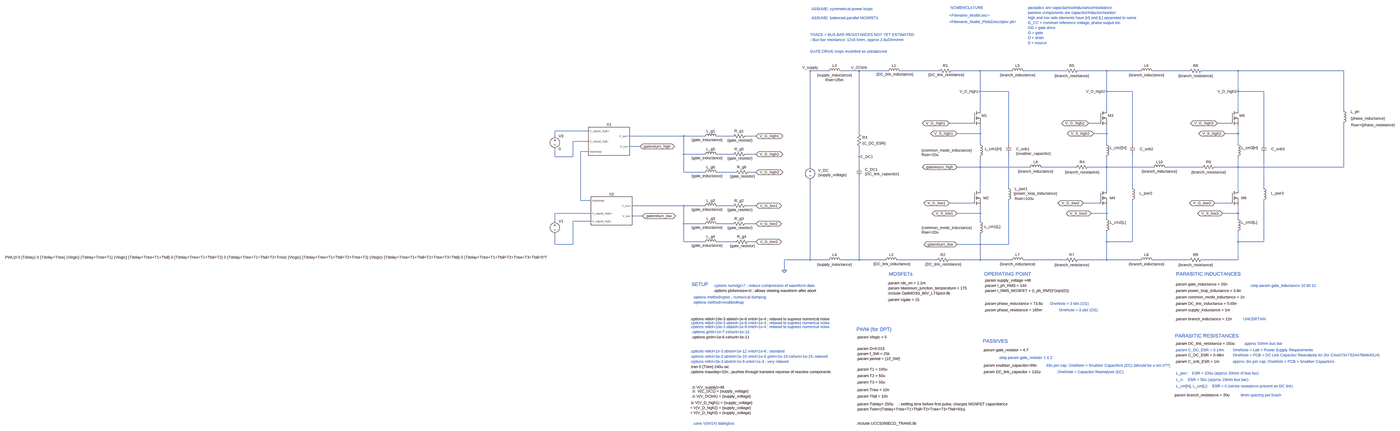
[diagram p0: schematic InverterUnbalancedDriverDPT.asc, whole sheet]
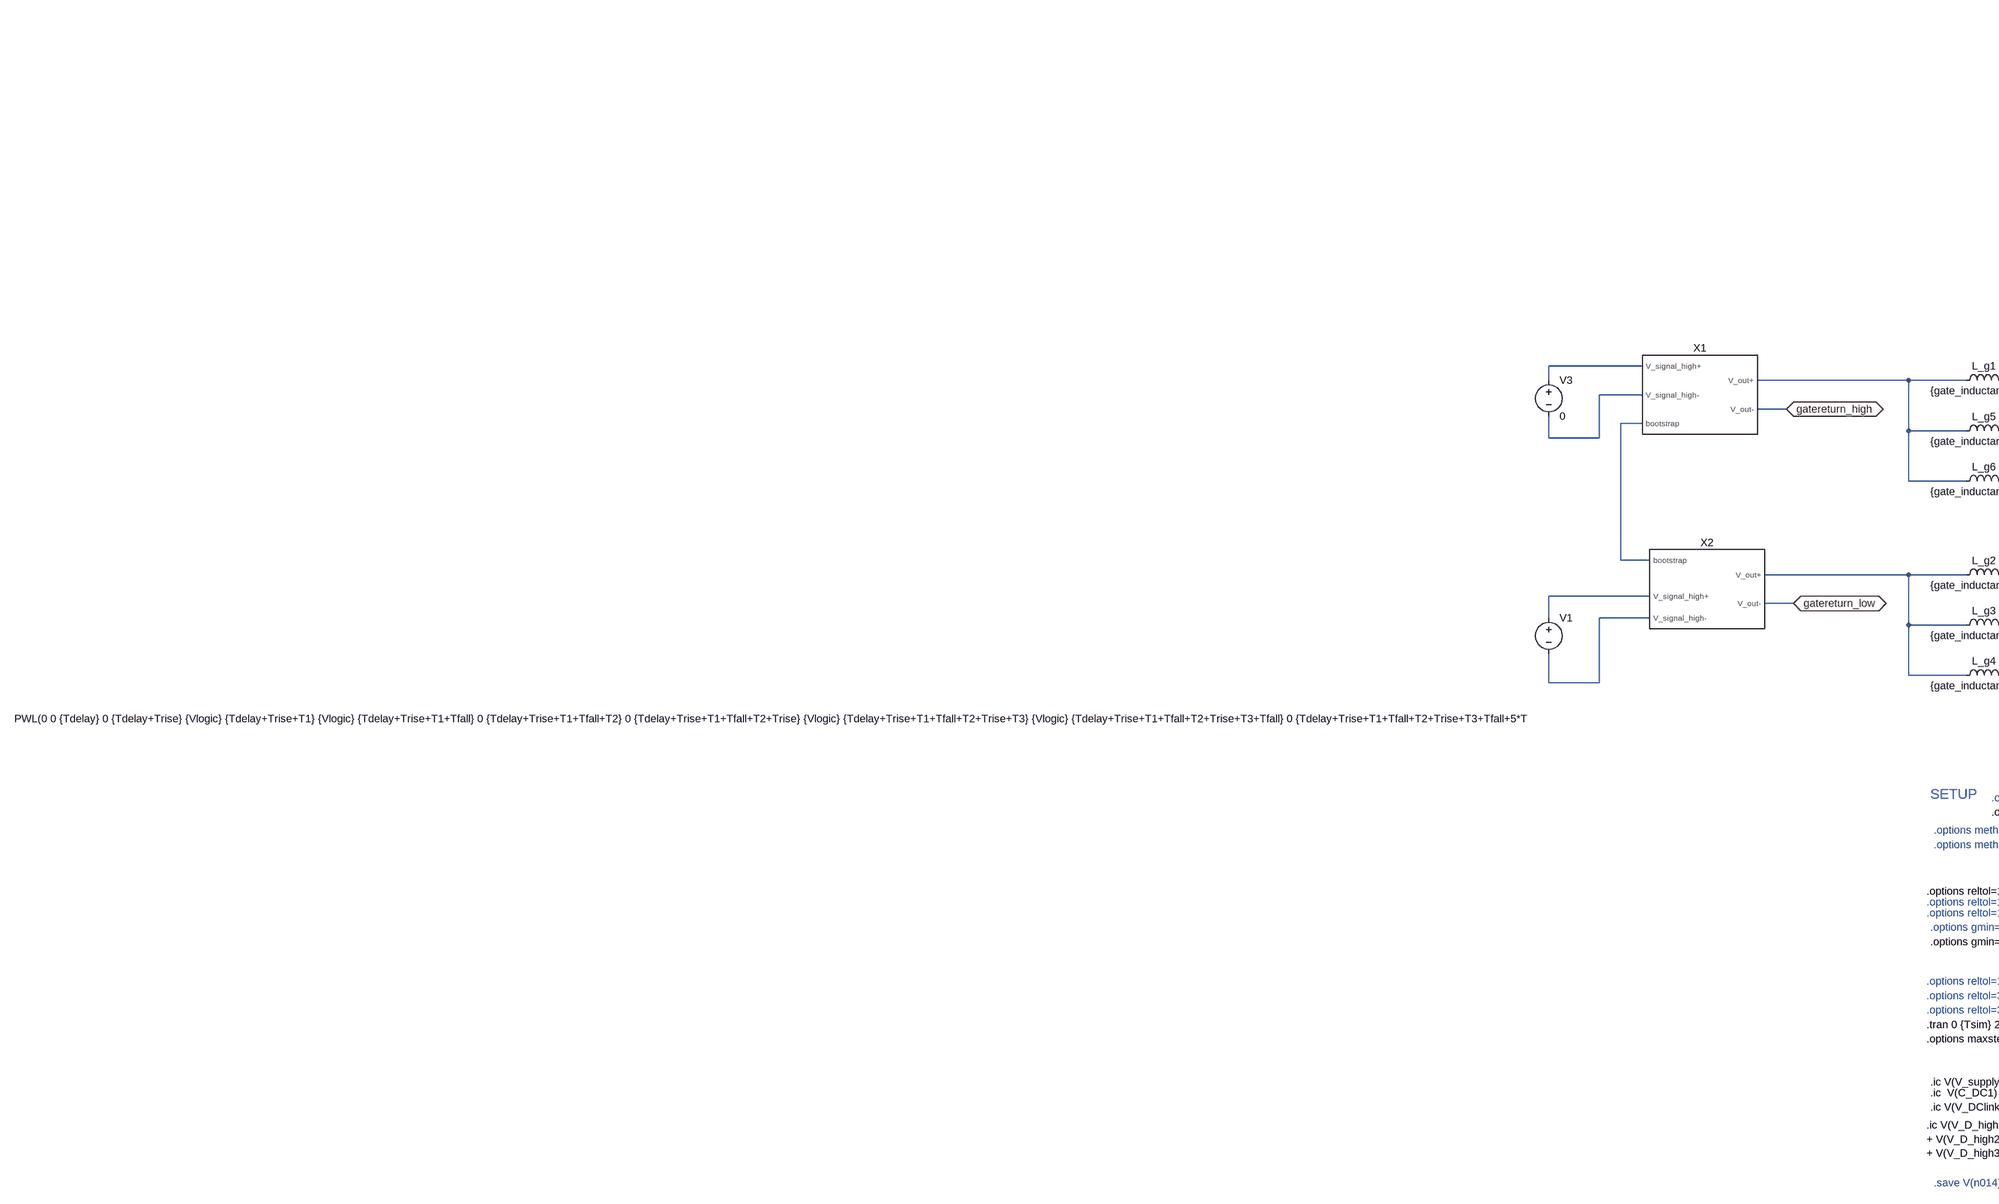
[diagram p1: schematic InverterUnbalancedDriverDPT.asc, part, row 1 of 1, column 1 of 2]
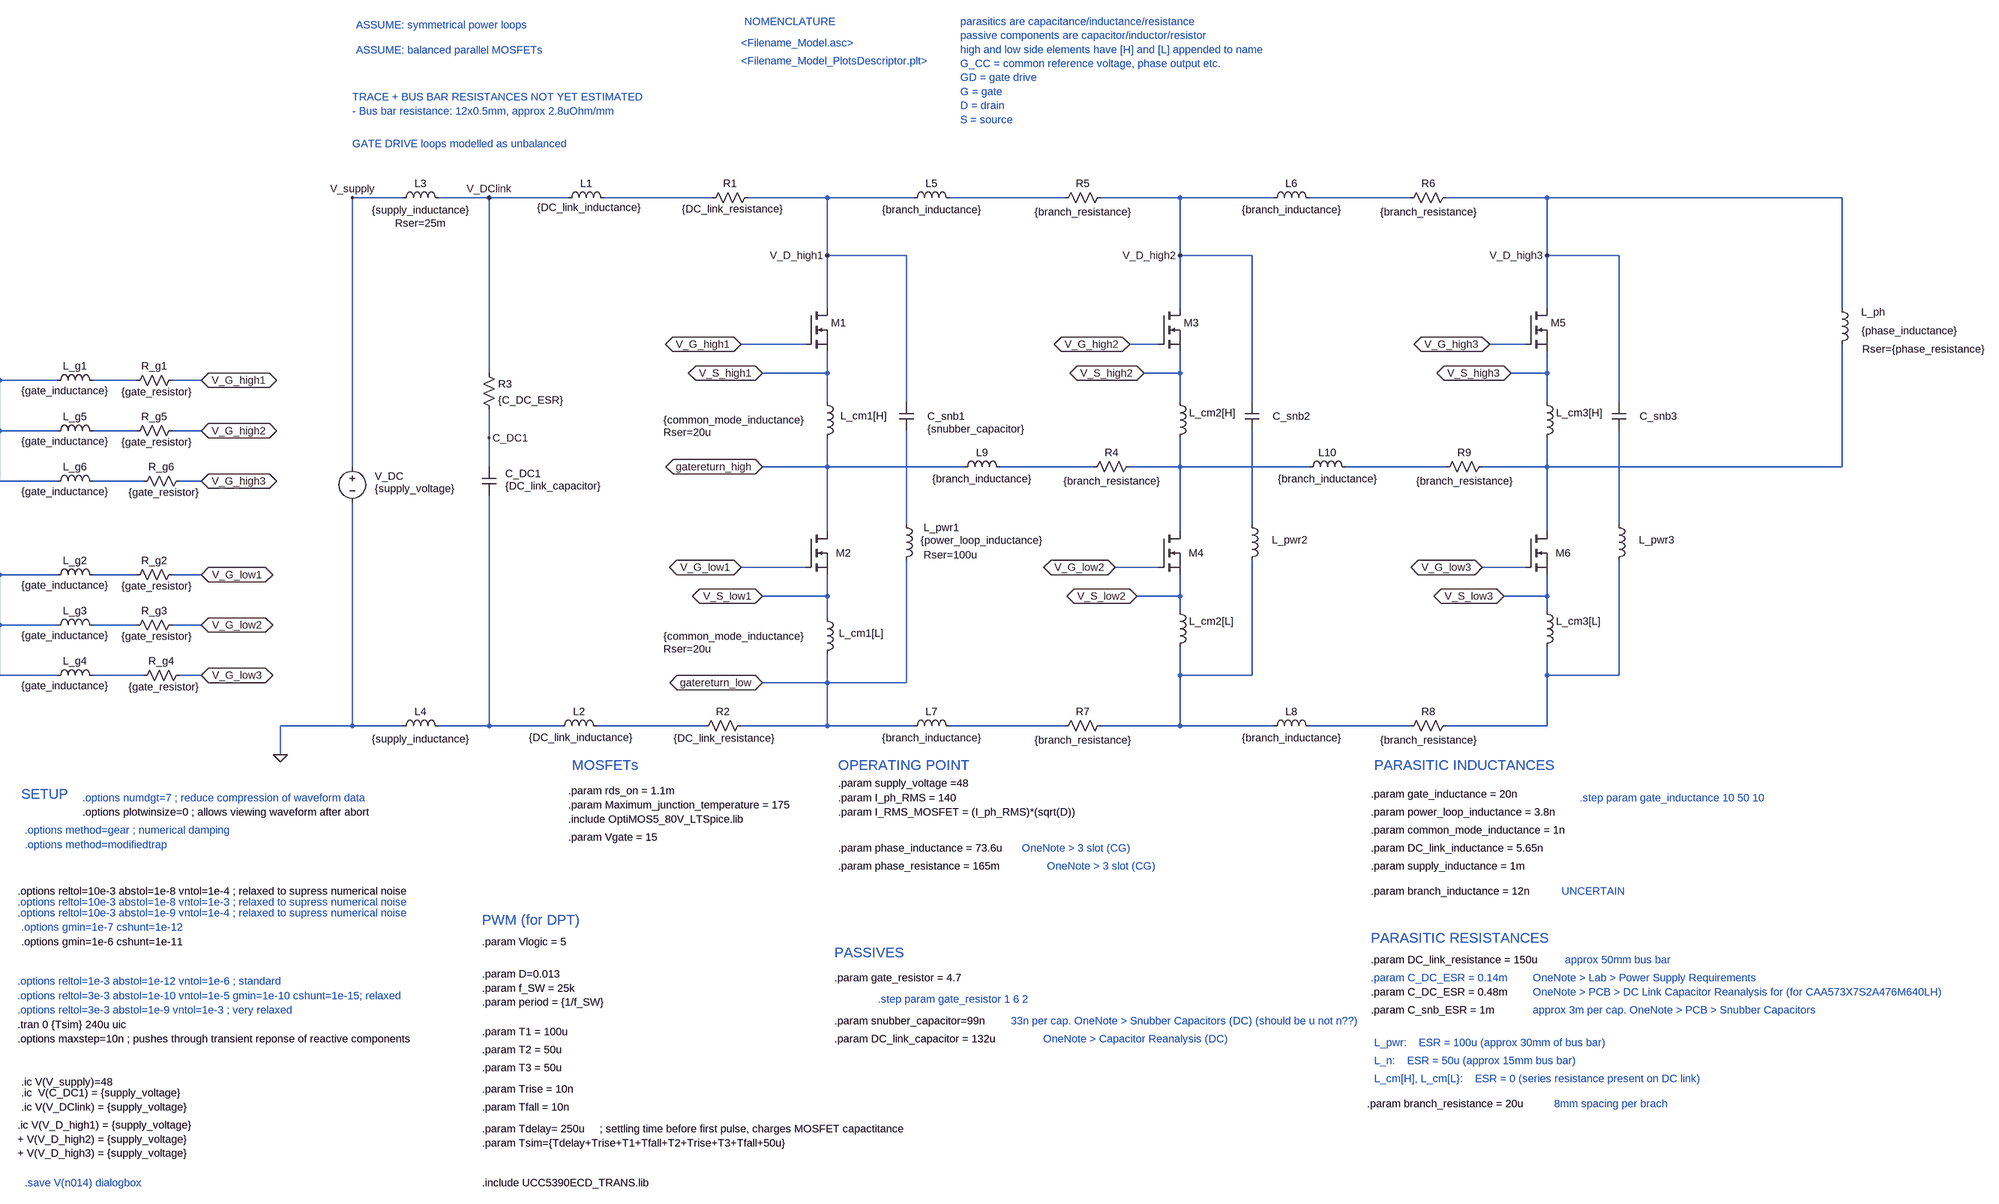
[diagram p2: schematic InverterUnbalancedDriverDPT.asc, part, row 1 of 1, column 2 of 2]
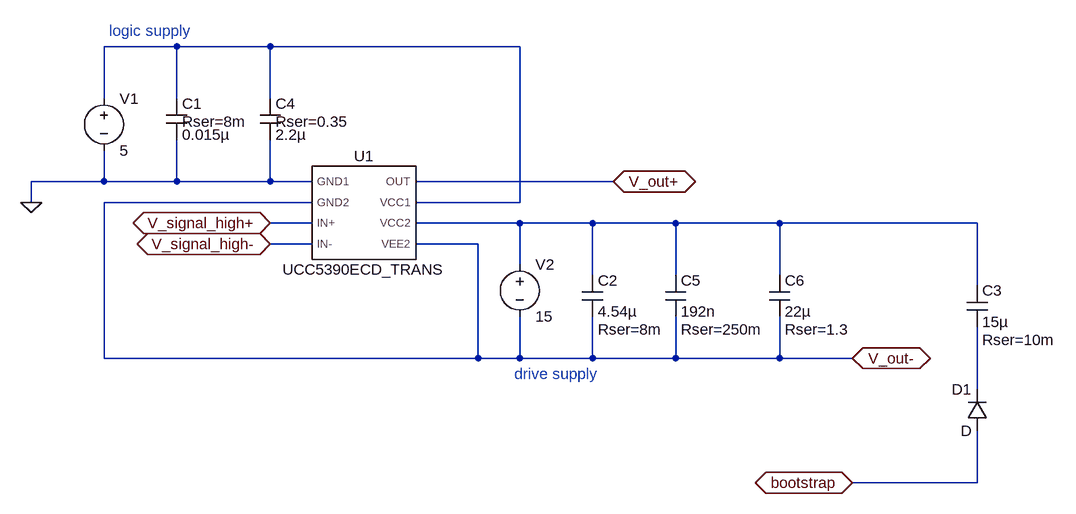
[diagram p3: sub-circuit gatedriverhigh.asc]
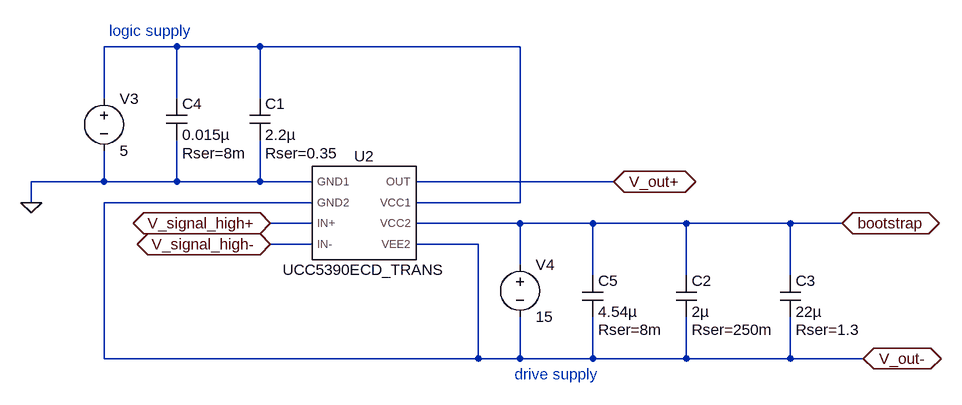
[diagram p4: sub-circuit gatedriverlow.asc]
InverterUnbalancedDriverDPT.asc, the LTspice schematic file:
Version 4.1
SHEET 1 7948 3392
WIRE 1136 -928 1024 -928
WIRE 1328 -928 1216 -928
WIRE 1504 -928 1328 -928
WIRE 1824 -928 1584 -928
WIRE 2080 -928 1904 -928
WIRE 2272 -928 2080 -928
WIRE 2608 -928 2352 -928
WIRE 2864 -928 2688 -928
WIRE 3072 -928 2864 -928
WIRE 3376 -928 3152 -928
WIRE 3680 -928 3456 -928
WIRE 4336 -928 3680 -928
WIRE 2080 -800 2080 -928
WIRE 2256 -800 2080 -800
WIRE 2864 -800 2864 -928
WIRE 3024 -800 2864 -800
WIRE 3680 -800 3680 -928
WIRE 3840 -800 3680 -800
WIRE 2080 -672 2080 -800
WIRE 2864 -672 2864 -800
WIRE 3680 -672 3680 -800
WIRE 4336 -672 4336 -928
WIRE 2032 -592 1888 -592
WIRE 2080 -592 2080 -608
WIRE 2816 -592 2752 -592
WIRE 2864 -592 2864 -608
WIRE 3632 -592 3552 -592
WIRE 3680 -592 3680 -608
WIRE -352 -544 -560 -544
WIRE 1328 -528 1328 -928
WIRE 2080 -528 2080 -576
WIRE 2080 -528 1936 -528
WIRE 2864 -528 2864 -576
WIRE 2864 -528 2784 -528
WIRE 3680 -528 3680 -576
WIRE 3680 -528 3600 -528
WIRE -560 -512 -560 -544
WIRE 240 -512 -96 -512
WIRE 368 -512 240 -512
WIRE 544 -512 448 -512
WIRE 688 -512 624 -512
WIRE -352 -480 -448 -480
WIRE 2080 -464 2080 -528
WIRE 2256 -464 2256 -800
WIRE 2864 -464 2864 -528
WIRE 3024 -464 3024 -800
WIRE 3680 -464 3680 -528
WIRE 3840 -464 3840 -800
WIRE -32 -448 -96 -448
WIRE -352 -416 -400 -416
WIRE 240 -400 240 -512
WIRE 368 -400 240 -400
WIRE 544 -400 448 -400
WIRE 688 -400 624 -400
WIRE -560 -384 -560 -432
WIRE -448 -384 -448 -480
WIRE -448 -384 -560 -384
WIRE 1328 -384 1328 -448
WIRE 1024 -320 1024 -928
WIRE 1328 -320 1328 -384
WIRE 2080 -320 2080 -384
WIRE 2080 -320 1936 -320
WIRE 2384 -320 2080 -320
WIRE 2672 -320 2464 -320
WIRE 2864 -320 2864 -384
WIRE 2864 -320 2752 -320
WIRE 3152 -320 2864 -320
WIRE 3456 -320 3232 -320
WIRE 3680 -320 3680 -384
WIRE 3680 -320 3536 -320
WIRE 4336 -320 4336 -592
WIRE 4336 -320 3680 -320
WIRE 240 -288 240 -400
WIRE 368 -288 240 -288
WIRE 560 -288 448 -288
WIRE 688 -288 640 -288
WIRE 2256 -192 2256 -400
WIRE 3024 -192 3024 -400
WIRE 3840 -192 3840 -400
WIRE 2080 -176 2080 -320
WIRE 2864 -176 2864 -320
WIRE 3680 -176 3680 -320
WIRE -400 -112 -400 -416
WIRE -336 -112 -400 -112
WIRE 2032 -96 1888 -96
WIRE 2816 -96 2720 -96
WIRE 3632 -96 3536 -96
WIRE 240 -80 -80 -80
WIRE 368 -80 240 -80
WIRE 544 -80 448 -80
WIRE 688 -80 624 -80
WIRE -336 -32 -560 -32
WIRE 2080 -32 2080 -80
WIRE 2080 -32 1936 -32
WIRE 2864 -32 2864 -80
WIRE 2864 -32 2768 -32
WIRE 3680 -32 3680 -80
WIRE 3680 -32 3584 -32
WIRE -16 -16 -80 -16
WIRE 2864 0 2864 -32
WIRE 3680 0 3680 -32
WIRE -560 16 -560 -32
WIRE -336 16 -448 16
WIRE 2080 16 2080 -32
WIRE 240 32 240 -80
WIRE 368 32 240 32
WIRE 544 32 448 32
WIRE 688 32 624 32
WIRE 240 144 240 32
WIRE 368 144 240 144
WIRE 560 144 448 144
WIRE 688 144 640 144
WIRE 2864 144 2864 80
WIRE 3024 144 3024 -112
WIRE 3024 144 2864 144
WIRE 3680 144 3680 80
WIRE 3840 144 3840 -112
WIRE 3840 144 3680 144
WIRE -560 160 -560 96
WIRE -448 160 -448 16
WIRE -448 160 -560 160
WIRE 2080 160 2080 96
WIRE 2080 160 1936 160
WIRE 2256 160 2256 -112
WIRE 2256 160 2080 160
WIRE 1024 256 1024 -240
WIRE 1024 256 864 256
WIRE 1136 256 1024 256
WIRE 1328 256 1328 -256
WIRE 1328 256 1216 256
WIRE 1488 256 1328 256
WIRE 1808 256 1568 256
WIRE 2080 256 2080 160
WIRE 2080 256 1888 256
WIRE 2272 256 2080 256
WIRE 2608 256 2352 256
WIRE 2864 256 2864 144
WIRE 2864 256 2688 256
WIRE 3072 256 2864 256
WIRE 3376 256 3152 256
WIRE 3680 256 3680 144
WIRE 3680 256 3456 256
WIRE 864 320 864 256
FLAG 688 -80 V_G_low1
IOPIN 688 -80 BiDir
FLAG 1888 -592 V_G_high1
IOPIN 1888 -592 BiDir
FLAG 1888 -96 V_G_low1
IOPIN 1888 -96 BiDir
FLAG 864 320 0
FLAG 1936 -320 gatereturn_high
IOPIN 1936 -320 BiDir
FLAG 2080 -800 V_D_high1
FLAG 1328 -928 V_DClink
FLAG 2752 -592 V_G_high2
IOPIN 2752 -592 BiDir
FLAG 1936 -32 V_S_low1
IOPIN 1936 -32 BiDir
FLAG 2720 -96 V_G_low2
IOPIN 2720 -96 BiDir
FLAG 3536 -96 V_G_low3
IOPIN 3536 -96 BiDir
FLAG 3552 -592 V_G_high3
IOPIN 3552 -592 BiDir
FLAG 2784 -528 V_S_high2
IOPIN 2784 -528 BiDir
FLAG 3600 -528 V_S_high3
IOPIN 3600 -528 BiDir
FLAG 2768 -32 V_S_low2
IOPIN 2768 -32 BiDir
FLAG 3584 -32 V_S_low3
IOPIN 3584 -32 BiDir
FLAG 1328 -384 C_DC1
FLAG 1936 -528 V_S_high1
IOPIN 1936 -528 BiDir
FLAG 1024 -928 V_supply
FLAG 2864 -800 V_D_high2
FLAG 3680 -800 V_D_high3
FLAG 1936 160 gatereturn_low
IOPIN 1936 160 BiDir
FLAG 688 32 V_G_low2
IOPIN 688 32 BiDir
FLAG 688 144 V_G_low3
IOPIN 688 144 BiDir
FLAG -32 -448 gatereturn_high
IOPIN -32 -448 BiDir
FLAG 688 -512 V_G_high1
IOPIN 688 -512 BiDir
FLAG 688 -400 V_G_high2
IOPIN 688 -400 BiDir
FLAG 688 -288 V_G_high3
IOPIN 688 -288 BiDir
FLAG -16 -16 gatereturn_low
IOPIN -16 -16 BiDir
SYMBOL voltage 1024 -336 R0
WINDOW 3 50 65 Left 2
WINDOW 0 50 37 Left 2
WINDOW 123 0 0 Left 0
SYMATTR Value {supply_voltage}
SYMATTR InstName V_DC
SYMATTR SpiceLine Rser=0
SYMBOL cap 1312 -320 R0
WINDOW 0 52 15 Left 2
WINDOW 3 52 43 Left 2
SYMATTR InstName C_DC1
SYMATTR Value {DC_link_capacitor}
SYMATTR SpiceLine Rser=0
SYMBOL cap 2240 -464 R0
WINDOW 0 62 32 Left 2
WINDOW 3 62 60 Left 2
SYMATTR InstName C_snb1
SYMATTR Value {snubber_capacitor}
SYMATTR SpiceLine Rser=0
SYMBOL ind 4320 -688 R0
WINDOW 0 58 24 Left 2
WINDOW 3 59 66 Left 2
WINDOW 39 61 107 Left 2
SYMATTR InstName L_ph
SYMATTR Value {phase_inductance}
SYMATTR SpiceLine Rser={phase_resistance}
SYMBOL nmos 2032 -672 R0
WINDOW 3 56 72 Invisible 2
SYMATTR Value IPTG011N08NM5_L0
SYMATTR InstName M1
SYMATTR Prefix X
SYMBOL nmos 2032 -176 R0
WINDOW 0 67 48 Left 2
WINDOW 3 56 72 Invisible 2
SYMATTR InstName M2
SYMATTR Value IPTG011N08NM5_L0
SYMATTR Prefix X
SYMBOL ind 2064 -480 R0
WINDOW 3 -348 56 Left 2
WINDOW 0 45 47 Left 2
WINDOW 39 -348 84 Left 2
SYMATTR Value {common_mode_inductance}
SYMATTR InstName L_cm1[H]
SYMATTR SpiceLine Rser=20u
SYMBOL ind 2064 0 R0
WINDOW 3 -348 57 Left 2
WINDOW 0 42 50 Left 2
WINDOW 39 -348 85 Left 2
SYMATTR Value {common_mode_inductance}
SYMATTR InstName L_cm1[L]
SYMATTR SpiceLine Rser=20u
SYMBOL ind 2240 -208 R0
WINDOW 0 54 23 Left 2
WINDOW 3 47 52 Left 2
WINDOW 39 54 84 Left 2
SYMATTR InstName L_pwr1
SYMATTR Value {power_loop_inductance}
SYMATTR SpiceLine Rser=100u
SYMBOL cap 3008 -464 R0
WINDOW 0 62 32 Left 2
WINDOW 3 24 56 Invisible 2
SYMATTR InstName C_snb2
SYMATTR Value {snubber_capacitor}
SYMBOL nmos 2816 -672 R0
WINDOW 3 56 72 Invisible 2
SYMATTR Value IPTG011N08NM5_L0
SYMATTR InstName M3
SYMATTR Prefix X
SYMBOL nmos 2816 -176 R0
WINDOW 0 67 48 Left 2
WINDOW 3 56 72 Invisible 2
SYMATTR InstName M4
SYMATTR Value IPTG011N08NM5_L0
SYMATTR Prefix X
SYMBOL ind 2848 -480 R0
WINDOW 3 36 80 Invisible 2
SYMATTR Value {common_mode_inductance}
SYMATTR InstName L_cm2[H]
SYMATTR SpiceLine Rser=20u
SYMBOL ind 2848 -16 R0
WINDOW 3 36 80 Invisible 2
SYMATTR Value {common_mode_inductance}
SYMATTR InstName L_cm2[L]
SYMATTR SpiceLine Rser=20u
SYMBOL ind 3008 -208 R0
WINDOW 0 60 51 Left 2
WINDOW 3 36 80 Invisible 2
SYMATTR InstName L_pwr2
SYMATTR Value {power_loop_inductance}
SYMATTR SpiceLine Rser=100u
SYMBOL cap 3824 -464 R0
WINDOW 0 62 32 Left 2
WINDOW 3 24 56 Invisible 2
SYMATTR InstName C_snb3
SYMATTR Value {snubber_capacitor}
SYMBOL nmos 3632 -672 R0
WINDOW 3 56 72 Invisible 2
SYMATTR Value IPTG011N08NM5_L0
SYMATTR InstName M5
SYMATTR Prefix X
SYMBOL nmos 3632 -176 R0
WINDOW 0 67 48 Left 2
WINDOW 3 56 72 Invisible 2
SYMATTR InstName M6
SYMATTR Value IPTG011N08NM5_L0
SYMATTR Prefix X
SYMBOL ind 3664 -480 R0
WINDOW 3 36 80 Invisible 2
SYMATTR Value {common_mode_inductance}
SYMATTR InstName L_cm3[H]
SYMATTR SpiceLine Rser=20u
SYMBOL ind 3664 -16 R0
WINDOW 3 36 80 Invisible 2
SYMATTR Value {common_mode_inductance}
SYMATTR InstName L_cm3[L]
SYMATTR SpiceLine Rser=20u
SYMBOL ind 3824 -208 R0
WINDOW 0 60 51 Left 2
WINDOW 3 36 80 Invisible 2
SYMATTR InstName L_pwr3
SYMATTR Value {power_loop_inductance}
SYMATTR SpiceLine Rser=100u
SYMBOL ind 1488 -912 R270
WINDOW 0 32 56 VTop 2
WINDOW 3 -21 62 VTop 2
SYMATTR InstName L1
SYMATTR Value {DC_link_inductance}
SYMATTR SpiceLine Rser=0
SYMBOL ind 1472 272 R270
WINDOW 0 32 56 VTop 2
WINDOW 3 -26 60 VTop 2
SYMATTR InstName L2
SYMATTR Value {DC_link_inductance}
SYMATTR SpiceLine Rser=0
SYMBOL res 1920 -944 R90
WINDOW 0 0 56 VBottom 2
WINDOW 3 57 51 VBottom 2
SYMATTR InstName R1
SYMATTR Value {DC_link_resistance}
SYMBOL res 1904 240 R90
WINDOW 0 0 56 VBottom 2
WINDOW 3 59 54 VBottom 2
SYMATTR InstName R2
SYMATTR Value {DC_link_resistance}
SYMBOL ind 1120 -912 R270
WINDOW 0 32 56 VTop 2
WINDOW 3 -27 56 VTop 2
WINDOW 39 -56 55 VTop 2
SYMATTR InstName L3
SYMATTR Value {supply_inductance}
SYMATTR SpiceLine Rser=25m
SYMBOL ind 1120 272 R270
WINDOW 0 32 56 VTop 2
WINDOW 3 -29 56 VTop 2
SYMATTR InstName L4
SYMATTR Value {supply_inductance}
SYMATTR SpiceLine Rser=25m
SYMBOL res 1312 -544 R0
SYMATTR InstName R3
SYMATTR Value {C_DC_ESR}
SYMBOL voltage -560 0 R0
WINDOW 123 0 0 Left 0
WINDOW 39 0 0 Left 0
WINDOW 3 -3411 240 Left 2
SYMATTR Value PWL(0 0 {Tdelay} 0 {Tdelay+Trise} {Vlogic} {Tdelay+Trise+T1} {Vlogic} {Tdelay+Trise+T1+Tfall} 0 {Tdelay+Trise+T1+Tfall+T2} 0 {Tdelay+Trise+T1+Tfall+T2+Trise} {Vlogic} {Tdelay+Trise+T1+Tfall+T2+Trise+T3} {Vlogic} {Tdelay+Trise+T1+Tfall+T2+Trise+T3+Tfall} 0 {Tdelay+Trise+T1+Tfall+T2+Trise+T3+Tfall+5*Tdelay} 0)
SYMATTR InstName V1
SYMBOL ind 2256 -912 R270
WINDOW 0 32 56 VTop 2
WINDOW 3 5 56 VBottom 2
SYMATTR InstName L5
SYMATTR Value {branch_inductance}
SYMATTR SpiceLine Rser=1m
SYMBOL res 2704 -944 R90
WINDOW 0 0 56 VBottom 2
WINDOW 3 32 56 VTop 2
SYMATTR InstName R5
SYMATTR Value {branch_resistance}
SYMBOL ind 3056 -912 R270
WINDOW 0 32 56 VTop 2
WINDOW 3 5 56 VBottom 2
SYMATTR InstName L6
SYMATTR Value {branch_inductance}
SYMATTR SpiceLine Rser=1m
SYMBOL res 3472 -944 R90
WINDOW 0 0 56 VBottom 2
WINDOW 3 32 56 VTop 2
SYMATTR InstName R6
SYMATTR Value {branch_resistance}
SYMBOL ind 2256 272 R270
WINDOW 0 32 56 VTop 2
WINDOW 3 5 56 VBottom 2
SYMATTR InstName L7
SYMATTR Value {branch_inductance}
SYMATTR SpiceLine Rser=1m
SYMBOL res 2704 240 R90
WINDOW 0 0 56 VBottom 2
WINDOW 3 32 56 VTop 2
SYMATTR InstName R7
SYMATTR Value {branch_resistance}
SYMBOL ind 3056 272 R270
WINDOW 0 32 56 VTop 2
WINDOW 3 5 56 VBottom 2
SYMATTR InstName L8
SYMATTR Value {branch_inductance}
SYMATTR SpiceLine Rser=1m
SYMBOL res 3472 240 R90
WINDOW 0 0 56 VBottom 2
WINDOW 3 32 56 VTop 2
SYMATTR InstName R8
SYMATTR Value {branch_resistance}
SYMBOL ind 352 -64 R270
WINDOW 0 32 56 VTop 2
WINDOW 3 -23 33 VTop 2
SYMATTR InstName L_g2
SYMATTR Value {gate_inductance}
SYMATTR SpiceLine Rser=0
SYMBOL res 528 -64 R270
WINDOW 0 32 56 VTop 2
WINDOW 3 -25 61 VTop 2
SYMATTR InstName R_g2
SYMATTR Value {gate_resistor}
SYMBOL ind 352 48 R270
WINDOW 0 32 56 VTop 2
WINDOW 3 -23 33 VTop 2
SYMATTR InstName L_g3
SYMATTR Value {gate_inductance}
SYMATTR SpiceLine Rser=0
SYMBOL ind 352 160 R270
WINDOW 0 32 56 VTop 2
WINDOW 3 -23 33 VTop 2
SYMATTR InstName L_g4
SYMATTR Value {gate_inductance}
SYMATTR SpiceLine Rser=0
SYMBOL res 528 48 R270
WINDOW 0 32 56 VTop 2
WINDOW 3 -25 61 VTop 2
SYMATTR InstName R_g3
SYMATTR Value {gate_resistor}
SYMBOL res 544 160 R270
WINDOW 0 32 56 VTop 2
WINDOW 3 -25 61 VTop 2
SYMATTR InstName R_g4
SYMATTR Value {gate_resistor}
SYMBOL voltage -560 -528 R0
WINDOW 123 0 0 Left 0
WINDOW 39 0 0 Left 0
SYMATTR InstName V3
SYMATTR Value 0
SYMBOL ind 352 -496 R270
WINDOW 0 32 56 VTop 2
WINDOW 3 -23 33 VTop 2
SYMATTR InstName L_g1
SYMATTR Value {gate_inductance}
SYMATTR SpiceLine Rser=0
SYMBOL res 528 -496 R270
WINDOW 0 32 56 VTop 2
WINDOW 3 -25 61 VTop 2
SYMATTR InstName R_g1
SYMATTR Value {gate_resistor}
SYMBOL ind 352 -384 R270
WINDOW 0 32 56 VTop 2
WINDOW 3 -23 33 VTop 2
SYMATTR InstName L_g5
SYMATTR Value {gate_inductance}
SYMATTR SpiceLine Rser=0
SYMBOL ind 352 -272 R270
WINDOW 0 32 56 VTop 2
WINDOW 3 -23 33 VTop 2
SYMATTR InstName L_g6
SYMATTR Value {gate_inductance}
SYMATTR SpiceLine Rser=0
SYMBOL res 528 -384 R270
WINDOW 0 32 56 VTop 2
WINDOW 3 -25 61 VTop 2
SYMATTR InstName R_g5
SYMATTR Value {gate_resistor}
SYMBOL res 544 -272 R270
WINDOW 0 32 56 VTop 2
WINDOW 3 -25 61 VTop 2
SYMATTR InstName R_g6
SYMATTR Value {gate_resistor}
SYMBOL GateDriverHigh -224 -480 R0
SYMATTR InstName X1
SYMBOL GateDriverLow -208 -48 R0
SYMATTR InstName X2
SYMBOL ind 2368 -304 R270
WINDOW 0 32 56 VTop 2
WINDOW 3 5 56 VBottom 2
SYMATTR InstName L9
SYMATTR Value {branch_inductance}
SYMATTR SpiceLine Rser=1m
SYMBOL res 2768 -336 R90
WINDOW 0 0 56 VBottom 2
WINDOW 3 32 56 VTop 2
SYMATTR InstName R4
SYMATTR Value {branch_resistance}
SYMBOL ind 3136 -304 R270
WINDOW 0 32 56 VTop 2
WINDOW 3 5 56 VBottom 2
SYMATTR InstName L10
SYMATTR Value {branch_inductance}
SYMATTR SpiceLine Rser=1m
SYMBOL res 3552 -336 R90
WINDOW 0 0 56 VBottom 2
WINDOW 3 32 56 VTop 2
SYMATTR InstName R9
SYMATTR Value {branch_resistance}
TEXT 1312 808 Left 2 !.param D=0.013\n.param f_SW = 25k\n.param period = {1/f_SW}
TEXT 280 824 Left 2 ;.options reltol=1e-3 abstol=1e-12 vntol=1e-6 ; standard
TEXT 1504 464 Left 2 !.include OptiMOS5_80V_LTSpice.lib
TEXT 2096 912 Left 2 !.param snubber_capacitor=99n
TEXT 2096 952 Left 2 !.param DC_link_capacitor = 132u
TEXT 2104 384 Left 2 !.param supply_voltage =48
TEXT 2104 568 Left 2 !.param phase_resistance = 165m
TEXT 2104 528 Left 2 !.param phase_inductance = 73.6u
TEXT 2104 416 Left 2 !.param I_ph_RMS = 140
TEXT 2104 448 Left 2 !.param I_RMS_MOSFET = (I_ph_RMS)*(sqrt(D))
TEXT 1504 432 Left 2 !.param Maximum_junction_temperature = 175
TEXT 1504 400 Left 2 !.param rds_on = 1.1m
TEXT 3288 488 Left 2 !.param common_mode_inductance = 1n
TEXT 3288 448 Left 2 !.param power_loop_inductance = 3.8n
TEXT 2096 816 Left 2 !.param gate_resistor = 4.7
TEXT 3288 408 Left 2 !.param gate_inductance = 20n
TEXT 288 408 Left 3 ;SETUP
TEXT 1512 344 Left 3 ;MOSFETs
TEXT 2104 344 Left 3 ;OPERATING POINT
TEXT 3296 344 Left 3 ;PARASITIC INDUCTANCES
TEXT 2096 760 Left 3 ;PASSIVES
TEXT 1504 504 Left 2 !.param Vgate = 15
TEXT 2192 864 Left 2 ;.step param gate_resistor 1 6 2
TEXT 3288 528 Left 2 !.param DC_link_inductance = 5.65n
TEXT 1032 -1312 Left 2 ;ASSUME: symmetrical power loops
TEXT 1024 -1152 Left 2 ;TRACE + BUS BAR RESISTANCES NOT YET ESTIMATED\n- Bus bar resistance: 12x0.5mm, approx 2.8uOhm/mm
TEXT 1032 -1256 Left 2 ;ASSUME: balanced parallel MOSFETs
TEXT 1024 -1048 Left 2 ;GATE DRIVE loops modelled as unbalanced
TEXT 3288 568 Left 2 !.param supply_inductance = 1m
TEXT 3288 728 Left 3 ;PARASITIC RESISTANCES
TEXT 3288 776 Left 2 !.param DC_link_resistance = 150u
TEXT 3288 816 Left 2 ;.param C_DC_ESR = 0.14m
TEXT 2560 952 Left 2 ;OneNote > Capacitor Reanalysis (DC)
TEXT 2488 912 Left 2 ;33n per cap. OneNote > Snubber Capacitors (DC) (should be u not n??)
TEXT 2512 528 Left 2 ;OneNote > 3 slot (CG)
TEXT 2568 568 Left 2 ;OneNote > 3 slot (CG)
TEXT 424 448 Left 2 !.options plotwinsize=0 ; allows viewing waveform after abort
TEXT 2376 -1320 Left 2 ;parasitics are capacitance/inductance/resistance\npassive components are capacitor/inductor/resistor\nhigh and low side elements have [H] and [L] appended to name\nG_CC = common reference voltage, phase output etc.\nGD = gate drive\nG = gate\nD = drain\nS = source
TEXT 280 952 Left 2 !.options maxstep=10n ; pushes through transient reponse of reactive components
TEXT 280 888 Left 2 ;.options reltol=3e-3 abstol=1e-9 vntol=1e-3 ; very relaxed
TEXT 280 672 Left 2 ;.options reltol=10e-3 abstol=1e-9 vntol=1e-4 ; relaxed to supress numerical noise
TEXT 1312 688 Left 3 ;PWM (for DPT)
TEXT 3296 960 Left 2 ;L_pwr:    ESR = 100u (approx 30mm of bus bar)
TEXT 3296 1040 Left 2 ;L_cm[H], L_cm[L}:    ESR = 0 (series resistance present on DC link)
TEXT 3296 1000 Left 2 ;L_n:    ESR = 50u (approx 15mm bus bar)
TEXT 3648 816 Left 2 ;OneNote > Lab > Power Supply Requirements
TEXT 3288 888 Left 2 !.param C_snb_ESR = 1m
TEXT 3288 848 Left 2 !.param C_DC_ESR = 0.48m
TEXT 3648 848 Left 2 ;OneNote > PCB > DC Link Capacitor Reanalysis for (for CAA573X7S2A476M640LH)
TEXT 3720 776 Left 2 ;approx 50mm bus bar
TEXT 3648 888 Left 2 ;approx 3m per cap. OneNote > PCB > Snubber Capacitors
TEXT 1312 936 Left 2 !.param T1 = 100u
TEXT 1312 976 Left 2 !.param T2 = 50u
TEXT 1312 1016 Left 2 !.param T3 = 50u
TEXT 1312 1064 Left 2 !.param Trise = 10n
TEXT 1312 1104 Left 2 !.param Tfall = 10n
TEXT 1312 1184 Left 2 !.param Tsim={Tdelay+Trise+T1+Tfall+T2+Trise+T3+Tfall+50u}
TEXT 280 920 Left 2 !.tran 0 {Tsim} 240u uic
TEXT 1312 1152 Left 2 !.param Tdelay= 250u     ; settling time before first pulse, charges MOSFET capactitance
TEXT 288 1072 Left 2 !.ic  V(C_DC1) = {supply_voltage}
TEXT 3752 416 Left 2 ;.step param gate_inductance 10 50 10
TEXT 296 488 Left 2 ;.options method=gear ; numerical damping
TEXT 280 856 Left 2 ;.options reltol=3e-3 abstol=1e-10 vntol=1e-5 gmin=1e-10 cshunt=1e-15; relaxed
TEXT 424 416 Left 2 ;.options numdgt=7 ; reduce compression of waveform data
TEXT 280 1144 Left 2 !.ic V(V_D_high1) = {supply_voltage}\n+ V(V_D_high2) = {supply_voltage}\n+ V(V_D_high3) = {supply_voltage}
TEXT 296 1272 Left 2 ;.save V(n014) dialogbox
TEXT 288 1104 Left 2 !.ic V(V_DClink) = {supply_voltage}
TEXT 1896 -1320 Left 2 ;NOMENCLATURE
TEXT 1888 -1272 Left 2 ;<Filename_Model.asc>
TEXT 1888 -1232 Left 2 ;<Filename_Model_PlotsDescriptor.plt>
TEXT 288 704 Left 2 ;.options gmin=1e-7 cshunt=1e-12
TEXT 288 1048 Left 2 !.ic V(V_supply)=48
TEXT 3288 624 Left 2 !.param branch_inductance = 12n
TEXT 3280 1096 Left 2 !.param branch_resistance = 20u
TEXT 280 648 Left 2 ;.options reltol=10e-3 abstol=1e-8 vntol=1e-3 ; relaxed to supress numerical noise
TEXT 1312 736 Left 2 !.param Vlogic = 5
TEXT 3696 1096 Left 2 ;8mm spacing per brach
TEXT 3712 624 Left 2 ;UNCERTAIN
TEXT 280 624 Left 2 !.options reltol=10e-3 abstol=1e-8 vntol=1e-4 ; relaxed to supress numerical noise
TEXT 1312 1272 Left 2 !.include UCC5390ECD_TRANS.lib
TEXT 296 520 Left 2 ;.options method=modifiedtrap
TEXT 288 736 Left 2 !.options gmin=1e-6 cshunt=1e-11

gatedriverhigh.asc, the sub-circuit schematic file:
Version 4.1
SHEET 1 1284 1192
WIRE -80 -128 -192 -128
WIRE 64 -128 -80 -128
WIRE 448 -128 64 -128
WIRE -192 -48 -192 -128
WIRE -80 -48 -80 -128
WIRE 64 -48 64 -128
WIRE -192 80 -192 32
WIRE -192 80 -304 80
WIRE -80 80 -80 16
WIRE -80 80 -192 80
WIRE 64 80 64 16
WIRE 64 80 -80 80
WIRE 128 80 64 80
WIRE 592 80 288 80
WIRE -304 112 -304 80
WIRE 128 112 -192 112
WIRE 448 112 448 -128
WIRE 448 112 288 112
WIRE 128 144 64 144
WIRE 448 144 288 144
WIRE 560 144 448 144
WIRE 688 144 560 144
WIRE 848 144 688 144
WIRE 1152 144 848 144
WIRE 128 176 64 176
WIRE 384 176 288 176
WIRE 448 208 448 144
WIRE 560 224 560 144
WIRE 688 224 688 144
WIRE 848 224 848 144
WIRE 1152 240 1152 144
WIRE -192 352 -192 112
WIRE 384 352 384 176
WIRE 384 352 -192 352
WIRE 448 352 448 288
WIRE 448 352 384 352
WIRE 560 352 560 288
WIRE 560 352 448 352
WIRE 688 352 688 288
WIRE 688 352 560 352
WIRE 848 352 848 288
WIRE 848 352 688 352
WIRE 960 352 848 352
WIRE 1152 400 1152 304
WIRE 1152 544 1152 464
WIRE 1152 544 960 544
FLAG 592 80 V_out+
IOPIN 592 80 BiDir
FLAG 64 144 V_signal_high+
IOPIN 64 144 BiDir
FLAG 64 176 V_signal_high-
IOPIN 64 176 BiDir
FLAG 960 352 V_out-
IOPIN 960 352 BiDir
FLAG -304 112 0
FLAG 960 544 bootstrap
IOPIN 960 544 BiDir
SYMBOL UCC5390ECD_TRANS 208 128 R0
SYMATTR InstName U1
SYMBOL voltage -192 -64 R0
WINDOW 123 0 0 Left 0
WINDOW 39 0 0 Left 0
SYMATTR InstName V1
SYMATTR Value 5
SYMBOL cap -96 -48 R0
WINDOW 39 24 36 Left 2
SYMATTR SpiceLine Rser=8m
SYMATTR InstName C1
SYMATTR Value 0.015µ
SYMBOL voltage 448 192 R0
WINDOW 123 0 0 Left 0
WINDOW 39 0 0 Left 0
SYMATTR InstName V2
SYMATTR Value 15
SYMBOL cap 544 224 R0
WINDOW 39 24 84 Left 2
SYMATTR SpiceLine Rser=8m
SYMATTR InstName C2
SYMATTR Value 4.54µ
SYMBOL cap 1136 240 R0
WINDOW 39 24 84 Left 2
SYMATTR SpiceLine Rser=10m
SYMATTR InstName C3
SYMATTR Value 15µ
SYMBOL diode 1168 464 R180
WINDOW 0 24 64 Left 2
WINDOW 3 24 0 Left 2
SYMATTR InstName D1
SYMBOL cap 48 -48 R0
WINDOW 39 24 36 Left 2
SYMATTR SpiceLine Rser=0.35
SYMATTR InstName C4
SYMATTR Value 2.2µ
SYMBOL cap 672 224 R0
WINDOW 39 24 84 Left 2
SYMATTR SpiceLine Rser=250m
SYMATTR InstName C5
SYMATTR Value 192n
SYMBOL cap 832 224 R0
WINDOW 39 24 84 Left 2
SYMATTR SpiceLine Rser=1.3
SYMATTR InstName C6
SYMATTR Value 22µ
TEXT -184 -152 Left 2 ;logic supply
TEXT 440 376 Left 2 ;drive supply

gatedriverlow.asc, the sub-circuit schematic file:
Version 4.1
SHEET 1 1132 1192
WIRE -80 496 -192 496
WIRE 48 496 -80 496
WIRE 448 496 48 496
WIRE -192 576 -192 496
WIRE -80 576 -80 496
WIRE 48 576 48 496
WIRE -192 704 -192 656
WIRE -192 704 -304 704
WIRE -80 704 -80 640
WIRE -80 704 -192 704
WIRE 48 704 48 640
WIRE 48 704 -80 704
WIRE 128 704 48 704
WIRE 592 704 288 704
WIRE -304 736 -304 704
WIRE 128 736 -192 736
WIRE 448 736 448 496
WIRE 448 736 288 736
WIRE 128 768 64 768
WIRE 448 768 288 768
WIRE 560 768 448 768
WIRE 704 768 560 768
WIRE 864 768 704 768
WIRE 944 768 864 768
WIRE 128 800 64 800
WIRE 384 800 288 800
WIRE 448 832 448 768
WIRE 560 848 560 768
WIRE 704 848 704 768
WIRE 864 848 864 768
WIRE -192 976 -192 736
WIRE 384 976 384 800
WIRE 384 976 -192 976
WIRE 448 976 448 912
WIRE 448 976 384 976
WIRE 560 976 560 912
WIRE 560 976 448 976
WIRE 704 976 704 912
WIRE 704 976 560 976
WIRE 864 976 864 912
WIRE 864 976 704 976
WIRE 976 976 864 976
FLAG 592 704 V_out+
IOPIN 592 704 BiDir
FLAG 64 768 V_signal_high+
IOPIN 64 768 BiDir
FLAG 64 800 V_signal_high-
IOPIN 64 800 BiDir
FLAG 976 976 V_out-
IOPIN 976 976 BiDir
FLAG -304 736 0
FLAG 944 768 bootstrap
IOPIN 944 768 BiDir
SYMBOL UCC5390ECD_TRANS 208 752 R0
SYMATTR InstName U2
SYMBOL voltage -192 560 R0
WINDOW 123 0 0 Left 0
WINDOW 39 0 0 Left 0
SYMATTR InstName V3
SYMATTR Value 5
SYMBOL cap -96 576 R0
WINDOW 39 24 84 Left 2
SYMATTR SpiceLine Rser=8m
SYMATTR InstName C4
SYMATTR Value 0.015µ
SYMBOL voltage 448 816 R0
WINDOW 123 0 0 Left 0
WINDOW 39 0 0 Left 0
SYMATTR InstName V4
SYMATTR Value 15
SYMBOL cap 544 848 R0
WINDOW 39 24 84 Left 2
SYMATTR SpiceLine Rser=8m
SYMATTR InstName C5
SYMATTR Value 4.54µ
SYMBOL cap 32 576 R0
WINDOW 39 24 84 Left 2
SYMATTR SpiceLine Rser=0.35
SYMATTR InstName C1
SYMATTR Value 2.2µ
SYMBOL cap 688 848 R0
WINDOW 39 24 84 Left 2
SYMATTR SpiceLine Rser=250m
SYMATTR InstName C2
SYMATTR Value 2µ
SYMBOL cap 848 848 R0
WINDOW 39 24 84 Left 2
SYMATTR SpiceLine Rser=1.3
SYMATTR InstName C3
SYMATTR Value 22µ
TEXT -184 472 Left 2 ;logic supply
TEXT 440 1000 Left 2 ;drive supply

The netlist it stands for:
* InverterUnbalancedDriverDPT.asc
V_DC V_supply 0 {supply_voltage} Rser=0
C_DC1 C_DC1 N029 {DC_link_capacitor} Rser=0
C_snb1 V_D_high1 N018 {snubber_capacitor} Rser=0
L_ph V_D_high3 N016 {phase_inductance} Rser={phase_resistance}
X§M1 V_D_high1 V_G_high1 V_S_high1 IPTG011N08NM5_L0  ; pins D G S
X§M2 gatereturn_high V_G_low1 V_S_low1 IPTG011N08NM5_L0  ; pins D G S
L_cm1[H] V_S_high1 gatereturn_high {common_mode_inductance} Rser=20u
L_cm1[L] V_S_low1 gatereturn_low {common_mode_inductance} Rser=20u
L_pwr1 N018 gatereturn_low {power_loop_inductance} Rser=100u
C_snb2 V_D_high2 N019 {snubber_capacitor}
X§M3 V_D_high2 V_G_high2 V_S_high2 IPTG011N08NM5_L0  ; pins D G S
X§M4 N014 V_G_low2 V_S_low2 IPTG011N08NM5_L0  ; pins D G S
L_cm2[H] V_S_high2 N014 {common_mode_inductance} Rser=20u
L_cm2[L] V_S_low2 N027 {common_mode_inductance} Rser=20u
L_pwr2 N019 N027 {power_loop_inductance} Rser=100u
C_snb3 V_D_high3 N020 {snubber_capacitor}
X§M5 V_D_high3 V_G_high3 V_S_high3 IPTG011N08NM5_L0  ; pins D G S
X§M6 N016 V_G_low3 V_S_low3 IPTG011N08NM5_L0  ; pins D G S
L_cm3[H] V_S_high3 N016 {common_mode_inductance} Rser=20u
L_cm3[L] V_S_low3 N028 {common_mode_inductance} Rser=20u
L_pwr3 N020 N028 {power_loop_inductance} Rser=100u
L1 V_DClink N001 {DC_link_inductance} Rser=0
L2 N029 N030 {DC_link_inductance} Rser=0
R1 V_D_high1 N001 {DC_link_resistance}
R2 gatereturn_low N030 {DC_link_resistance}
L3 V_supply V_DClink {supply_inductance} Rser=25m
L4 0 N029 {supply_inductance} Rser=25m
R3 V_DClink C_DC1 {C_DC_ESR}
V1 N023 N024 PWL(0 0 {Tdelay} 0 {Tdelay+Trise} {Vlogic} {Tdelay+Trise+T1} {Vlogic} {Tdelay+Trise+T1+Tfall} 0 {Tdelay+Trise+T1+Tfall+T2} 0 {Tdelay+Trise+T1+Tfall+T2+Trise} {Vlogic} {Tdelay+Trise+T1+Tfall+T2+Trise+T3} {Vlogic} {Tdelay+Trise+T1+Tfall+T2+Trise+T3+Tfall} 0 {Tdelay+Trise+T1+Tfall+T2+Trise+T3+Tfall+5*Tdelay} 0)
L5 V_D_high1 N002 {branch_inductance} Rser=1m
R5 V_D_high2 N002 {branch_resistance}
L6 V_D_high2 N003 {branch_inductance} Rser=1m
R6 V_D_high3 N003 {branch_resistance}
L7 gatereturn_low N031 {branch_inductance} Rser=1m
R7 N027 N031 {branch_resistance}
L8 N027 N032 {branch_inductance} Rser=1m
R8 N028 N032 {branch_resistance}
L_g2 N021 N022 {gate_inductance} Rser=0
R_g2 N022 V_G_low1 {gate_resistor}
L_g3 N021 N025 {gate_inductance} Rser=0
L_g4 N021 N026 {gate_inductance} Rser=0
R_g3 N025 V_G_low2 {gate_resistor}
R_g4 N026 V_G_low3 {gate_resistor}
V3 N007 N010 0
L_g1 N008 N009 {gate_inductance} Rser=0
R_g1 N009 V_G_high1 {gate_resistor}
L_g5 N008 N012 {gate_inductance} Rser=0
L_g6 N008 N017 {gate_inductance} Rser=0
R_g5 N012 V_G_high2 {gate_resistor}
R_g6 N017 V_G_high3 {gate_resistor}
X§X1 N011 gatereturn_high N008 N007 N010 gatedriverhigh
X§X2 N011 gatereturn_low N021 N023 N024 gatedriverlow
L9 gatereturn_high N013 {branch_inductance} Rser=1m
R4 N014 N013 {branch_resistance}
L10 N014 N015 {branch_inductance} Rser=1m
R9 N016 N015 {branch_resistance}

* block symbol definitions
.subckt gatedriverhigh bootstrap V_out- V_out+ V_signal_high+ V_signal_high-
X§U1 0 V_out- V_signal_high+ V_signal_high- V_out+ N001 N002 V_out- UCC5390ECD_TRANS  ; pins GND1 GND2 IN+ IN- OUT VCC1 VCC2 VEE2
V1 N001 0 5
C1 N001 0 0.015µ Rser=8m
V2 N002 V_out- 15
C2 N002 V_out- 4.54µ Rser=8m
C3 N002 N003 15µ Rser=10m
D1 bootstrap N003 D
C4 N001 0 2.2µ Rser=0.35
C5 N002 V_out- 192n Rser=250m
C6 N002 V_out- 22µ Rser=1.3
* logic supply
* drive supply
.ends gatedriverhigh

.subckt gatedriverlow bootstrap V_out- V_out+ V_signal_high+ V_signal_high-
X§U2 0 V_out- V_signal_high+ V_signal_high- V_out+ N001 bootstrap V_out- UCC5390ECD_TRANS  ; pins GND1 GND2 IN+ IN- OUT VCC1 VCC2 VEE2
V3 N001 0 5
C4 N001 0 0.015µ Rser=8m
V4 bootstrap V_out- 15
C5 bootstrap V_out- 4.54µ Rser=8m
C1 N001 0 2.2µ Rser=0.35
C2 bootstrap V_out- 2µ Rser=250m
C3 bootstrap V_out- 22µ Rser=1.3
* logic supply
* drive supply
.ends gatedriverlow

.model D D
.lib standard.dio
.param D=0.013
.param f_SW = 25k
.param period = {1/f_SW}
* .options reltol=1e-3 abstol=1e-12 vntol=1e-6 ; standard
.include OptiMOS5_80V_LTSpice.lib
.param snubber_capacitor=99n
.param DC_link_capacitor = 132u
.param supply_voltage =48
.param phase_resistance = 165m
.param phase_inductance = 73.6u
.param I_ph_RMS = 140
.param I_RMS_MOSFET = (I_ph_RMS)*(sqrt(D))
.param Maximum_junction_temperature = 175
.param rds_on = 1.1m
.param common_mode_inductance = 1n
.param power_loop_inductance = 3.8n
.param gate_resistor = 4.7
.param gate_inductance = 20n
* SETUP
* MOSFETs
* OPERATING POINT
* PARASITIC INDUCTANCES
* PASSIVES
.param Vgate = 15
* .step param gate_resistor 1 6 2
.param DC_link_inductance = 5.65n
* ASSUME: symmetrical power loops
* TRACE + BUS BAR RESISTANCES NOT YET ESTIMATED
* - Bus bar resistance: 12x0.5mm, approx 2.8uOhm/mm
* ASSUME: balanced parallel MOSFETs
* GATE DRIVE loops modelled as unbalanced
.param supply_inductance = 1m
* PARASITIC RESISTANCES
.param DC_link_resistance = 150u
* .param C_DC_ESR = 0.14m
* OneNote > Capacitor Reanalysis (DC)
* 33n per cap. OneNote > Snubber Capacitors (DC) (should be u not n??)
* OneNote > 3 slot (CG)
* OneNote > 3 slot (CG)
.options plotwinsize=0 ; allows viewing waveform after abort
* parasitics are capacitance/inductance/resistance
* passive components are capacitor/inductor/resistor
* high and low side elements have [H] and [L] appended to name
* G_CC = common reference voltage, phase output etc.
* GD = gate drive
* G = gate
* D = drain
* S = source
.options maxstep=10n ; pushes through transient reponse of reactive components
* .options reltol=3e-3 abstol=1e-9 vntol=1e-3 ; very relaxed
* .options reltol=10e-3 abstol=1e-9 vntol=1e-4 ; relaxed to supress numerical noise
* PWM (for DPT)
* L_pwr:    ESR = 100u (approx 30mm of bus bar)
* L_cm[H], L_cm[L}:    ESR = 0 (series resistance present on DC link)
* L_n:    ESR = 50u (approx 15mm bus bar)
* OneNote > Lab > Power Supply Requirements
.param C_snb_ESR = 1m
.param C_DC_ESR = 0.48m
* OneNote > PCB > DC Link Capacitor Reanalysis for (for CAA573X7S2A476M640LH)
* approx 50mm bus bar
* approx 3m per cap. OneNote > PCB > Snubber Capacitors
.param T1 = 100u
.param T2 = 50u
.param T3 = 50u
.param Trise = 10n
.param Tfall = 10n
.param Tsim={Tdelay+Trise+T1+Tfall+T2+Trise+T3+Tfall+50u}
.tran 0 {Tsim} 240u uic
.param Tdelay= 250u     ; settling time before first pulse, charges MOSFET capactitance
.ic  V(C_DC1) = {supply_voltage}
* .step param gate_inductance 10 50 10
* .options method=gear ; numerical damping
* .options reltol=3e-3 abstol=1e-10 vntol=1e-5 gmin=1e-10 cshunt=1e-15; relaxed
* .options numdgt=7 ; reduce compression of waveform data
.ic V(V_D_high1) = {supply_voltage}
+ V(V_D_high2) = {supply_voltage}
+ V(V_D_high3) = {supply_voltage}
* .save V(n014) dialogbox
.ic V(V_DClink) = {supply_voltage}
* NOMENCLATURE
* <Filename_Model.asc>
* <Filename_Model_PlotsDescriptor.plt>
* .options gmin=1e-7 cshunt=1e-12
.ic V(V_supply)=48
.param branch_inductance = 12n
.param branch_resistance = 20u
* .options reltol=10e-3 abstol=1e-8 vntol=1e-3 ; relaxed to supress numerical noise
.param Vlogic = 5
* 8mm spacing per brach
* UNCERTAIN
.options reltol=10e-3 abstol=1e-8 vntol=1e-4 ; relaxed to supress numerical noise
.include UCC5390ECD_TRANS.lib
* .options method=modifiedtrap
.options gmin=1e-6 cshunt=1e-11
.lib UCC5390ECD_TRANS.LIB
.backanno
.end